# EAGLE schematic USBStick (EAGLE 8.4.1)
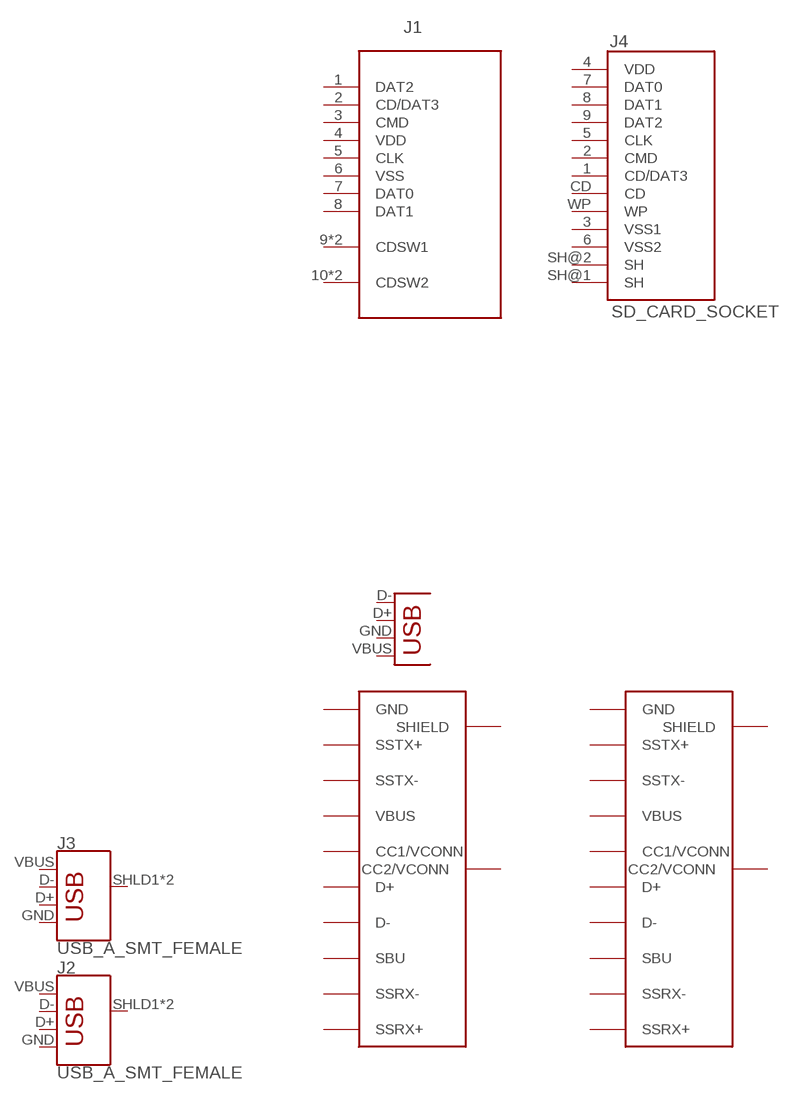
[diagram p0: schematic, sheet 1]

## Parts
J1  693071010811  [693071010811]
J2  USB_A_SMT_FEMALE  [USB-A-S-SILK-FEMALE]
J3  USB_A_SMT_FEMALE  [USB-A-S-SILK-FEMALE]
J4  SD_CARD_SOCKET  [SD]
U$1  USB-TYPE-C  [USB-TYPE-C-SMT]
U$2  USB-TYPE-C  [USB-TYPE-C-SMT]
X1  USB-A-H  [USB-A-H]
Unconnected: J1.1(DAT2) J1.2(CD/DAT3) J1.3(CMD) J1.4(VDD) J1.5(CLK) J1.6(VSS) J1.7(DAT0) J1.8(DAT1) J1.9(CDSW1) J1.9-1(CDSW1) J1.10(CDSW2) J1.10-1(CDSW2) J2.D+ J2.D- J2.SHLD1(SHIELD) J2.SHLD2(SHIELD) J3.D+ J3.D- J3.SHLD1(SHIELD) J3.SHLD2(SHIELD) J4.1(CD/DAT3) J4.2(CMD) J4.5(CLK) J4.7(DAT0) J4.8(DAT1) J4.9(DAT2) J4.CD J4.SH@1(SH) J4.SH@2(SH) J4.WP U$1.2(SSTX+) U$1.3(SSTX-) U$1.4(VBUS) U$1.5(CC1/VCONN) U$1.6(D+) U$1.7(D-) U$1.8(SBU) U$1.9(VBUS) U$1.10(SSRX-) U$1.11(SSRX+) U$1.B2(SSTX+) U$1.B3(SSTX-) U$1.B4(VBUS) U$1.B5(CC2/VCONN) U$1.B6(D+) U$1.B7(D-) U$1.B8(SBU) U$1.B9(VBUS) U$1.B10(SSRX-) U$1.B11(SSRX+) U$1.P$1(SHIELD) U$1.P$2(SHIELD) U$1.P$3(SHIELD) U$1.P$4(SHIELD) U$1.P$5(SHIELD) U$1.P$6(SHIELD) U$1.P$7(SHIELD) U$1.P$8(SHIELD) U$1.P$9(SHIELD) U$1.P$10(SHIELD) U$1.P$11(SHIELD) U$1.P$12(SHIELD) U$1.P$13(SHIELD) U$1.P$14(SHIELD) U$1.P$15(SHIELD) U$1.P$16(SHIELD) U$1.P$17(SHIELD) U$1.P$18(SHIELD) U$1.P$19(SHIELD) U$1.P$20(SHIELD) U$1.P$21(SHIELD) U$1.P$22(SHIELD) U$1.P$23(SHIELD) U$1.P$24(SHIELD) U$1.P$25(SHIELD) U$1.P$26(SHIELD) U$1.P$27(SHIELD) U$1.P$28(SHIELD) U$2.2(SSTX+) U$2.3(SSTX-) U$2.4(VBUS) U$2.5(CC1/VCONN) U$2.6(D+) U$2.7(D-) U$2.8(SBU) U$2.9(VBUS) U$2.10(SSRX-) U$2.11(SSRX+) U$2.B2(SSTX+) U$2.B3(SSTX-) U$2.B4(VBUS) U$2.B5(CC2/VCONN) U$2.B6(D+) U$2.B7(D-) U$2.B8(SBU) U$2.B9(VBUS) U$2.B10(SSRX-) U$2.B11(SSRX+) U$2.P$1(SHIELD) U$2.P$2(SHIELD) U$2.P$3(SHIELD) U$2.P$4(SHIELD) U$2.P$5(SHIELD) U$2.P$6(SHIELD) U$2.P$7(SHIELD) U$2.P$8(SHIELD) U$2.P$9(SHIELD) U$2.P$10(SHIELD) U$2.P$11(SHIELD) U$2.P$12(SHIELD) U$2.P$13(SHIELD) U$2.P$14(SHIELD) U$2.P$15(SHIELD) U$2.P$16(SHIELD) U$2.P$17(SHIELD) U$2.P$18(SHIELD) U$2.P$19(SHIELD) U$2.P$20(SHIELD) U$2.P$21(SHIELD) U$2.P$22(SHIELD) U$2.P$23(SHIELD) U$2.P$24(SHIELD) U$2.P$25(SHIELD) U$2.P$26(SHIELD) U$2.P$27(SHIELD) U$2.P$28(SHIELD) X1.D+(D-) X1.D-(D+) X1.GND(VBUS) X1.VBUS(GND)

## Power pins joined to a net without a drawn wire
GND: J2.GND J3.GND U$1.1(GND) U$1.12(GND) U$1.B1(GND) U$1.B12(GND) U$2.1(GND) U$2.12(GND) U$2.B1(GND) U$2.B12(GND)
VBUS: J2.VBUS J3.VBUS
VDD: J4.4(VDD)
VSS1: J4.3(VSS1)
VSS2: J4.6(VSS2)

## Library data of the parts
J1 = Wurth_Elektronik_Electromechanic_Input-Output_Connectors_rev17b:693071010811: WR-CRD MICRO SD CARD CONNECTOR PUSH & PUSH WITH CARD DETECTION 8PINS=>Code : Con_I-O_COM_CRD_SD_Micro_693071010811 <http://katalog.we-online.de/media/images/eican/Con_I-O_COM_CRD_SD_Micro_693071010811_pf2.jpg> Details see: http://katalog.we-online.de/en/em/CRD_SD_MICRO_PUSH_AND_PULL_8_PINS/693071010811 Created 2014-07-09, Karrer Zheng 2014 (C) Würth Elektronik
J2 J3 = SparkFun-Connectors:USB_A: USB-A Connector Male and female variants, as well as PTH and SMT variants SparkFun Products: SparkFun XBee Explorer Dongle <https://www.sparkfun.com/products/11697> PTH Male SparkFun MicroView-USB Programmer <https://www.sparkfun.com/products/12924> SMT Male SparkFun USB Type A Female Breakout <https://www.sparkfun.com/products/12700> SMT Female; PROD_ID: CONN-09520; SF_ID: PRT-09011
J4 = SparkFun-Connectors:SD_CARD_SOCKET: SD Memory Card Connector (standard "large" size) Push-push normal type, CD enable, WP enable. Here is the connector we sell at SparkFun: SD/MMC Socket <https://www.sparkfun.com/products/12769> (PRT-12769) Datasheet <https://cdn.sparkfun.com/datasheets/Prototyping/19608.pdf> It is used on these SparkFun products: SparkFun SD/MMC Card Breakout <https://www.sparkfun.com/products/12941> (BOB-12941) SD Sniffer <https://www.sparkfun.com/products/11468> (TOL-11468); PROD_ID: CONN-11976; SF_ID: PRT-12769
U$1 U$2 = lio:USB-TYPE-C
X1 = SparkFun:USB: USB Connectors USB-B-PTH is fully proven SKU : PRT-00139 USB-miniB is fully proven SKU : PRT-00587 USB-A-PCB is untested. USB-A-H is throughly reviewed, but untested. Spark Fun Electronics SKU : PRT-00437 USB-B-SMT is throughly reviewed, but untested. Needs silkscreen touching up. USB-A-S has not been used/tested USB-MB-H has not been used/tested